# Altium schematic sheet type-c_拓展板.SchDoc
size A4
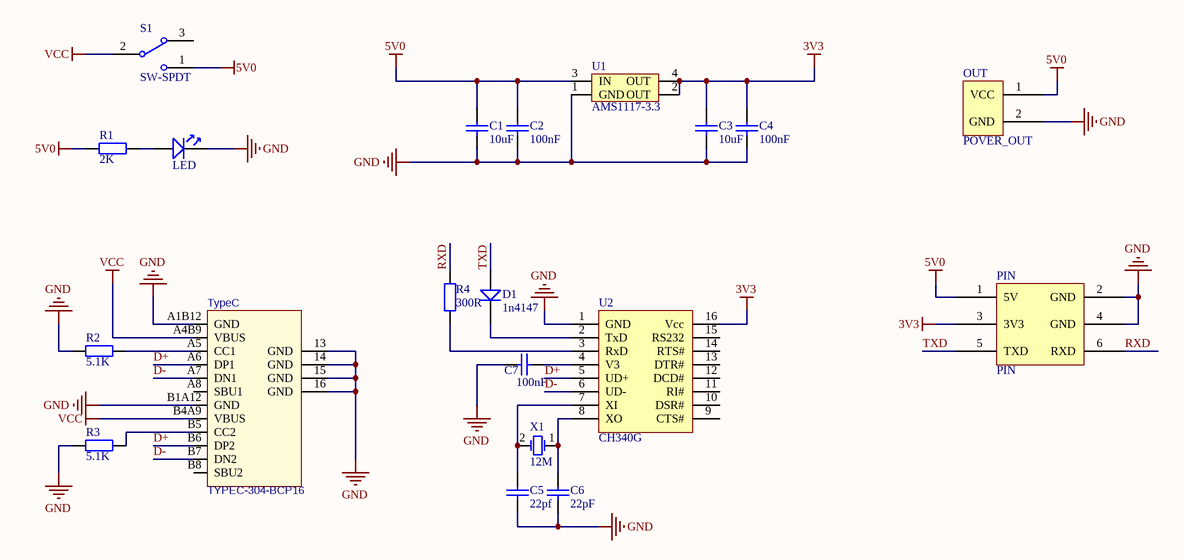
[diagram p0: type-c_拓展板.SchDoc]

## Parts
C1  10uF  [C0603]
C2  100nF  [C0603]
C3  10uF  [C0603]
C4  100nF  [C0603]
C5  22pf  [C0603]
C6  22pF  [C0603]
C7  100nF  [C0603]
D1  1n4147  [DIODE-SMA]
OUT  POVER_OUT  [P]
PIN  PIN  [HDR2.54-LI-2x3P]
PWR?  LED  [LED 0603R]
R1  2K  [R0603]
R2  5.1K  [R0603]
R3  5.1K  [R0603]
R4  300R  [R0603]
S1  SW-SPDT  [S]
TypeC  TYPEC-304-BCP16  [USB-C-SMD_TYPEC-304-BCP16]
U1  AMS1117-3.3  [AMS1117]
U2  CH340G  [SOP16_L]
X1  12M  [XTAL]

## Nets
3V3: C3.2 C4.2 PIN.3(3V3) U1.2(OUT) U1.4(OUT) U2.16(Vcc)
5V0: C1.2 C2.2 OUT.1(VCC) PIN.1(5V) R1.1 S1.1 U1.3(IN)
GND: C1.1 C2.1 C3.1 C4.1 C5.1 C6.1 C7.1 OUT.2(GND) PIN.2(GND) PIN.4(GND) PWR?.2 R2.1 R3.1 TypeC.13(GND) TypeC.14(GND) TypeC.15(GND) TypeC.16(GND) TypeC.A1B12(GND) TypeC.B1A12(GND) U1.1(GND) U2.1(GND)
VCC: S1.2 TypeC.A4B9(VBUS) TypeC.B4A9(VBUS)
D+: TypeC.A6(DP1) TypeC.B6(DP2) U2.5(UD+)
D-: TypeC.A7(DN1) TypeC.B7(DN2) U2.6(UD-)
RXD: PIN.6(RXD) R4.2
TXD: D1.1(+) PIN.5(TXD)
NetC5_2: C5.2 U2.7(XI) X1.2(OSC2)
NetC6_2: C6.2 U2.8(XO) X1.1(OSC1)
NetC7_2: C7.2 U2.4(V3)
NetD1_2: D1.2 U2.2(TxD)
NetPWR?_1: PWR?.1(+) R1.2
NetR2_2: R2.2 TypeC.A5(CC1)
NetR3_2: R3.2 TypeC.B5(CC2)
NetR4_1: R4.1 U2.3(RxD)

Not connected (* = marked no-connect by the designer): S1 3; TypeC A8(SBU1) B8(SBU2); U2 9(CTS#) 10(DSR#) 11(RI#) 12(DCD#) 13(DTR#) 14(RTS#) 15(RS232)

## Library data of the parts
C1-C7 = Cap: 贴片电容; value: 100uf
D1 = D: 二极管
OUT = POVER_IN
R1-R4 = R
S1 = SW-SPDT: 开关; Published: 24-Mar-1999; LatestRevisionDate: 17-Dec-2003; LatestRevisionNote: Schematic revised, PCB Footprint replaced.; DatasheetDocument: 05-Dec-2000; PackageReference: TL36WW15050; Publisher: Altium Limited; ComponentLink1Description: Manufacturer Link; ComponentLink1URL: http://www.apem.com
TypeC = TYPEC-304-BCP16: BOM_Manufacturer: XUNPU; Contributor: LCSC; BOM_Supplier: LCSC; BOM_Supplier Part: C720629; BOM_Manufacturer Part: TYPEC-304-BCP16; spicePre: U; spiceSymbolName: TYPEC-304-BCP16
U1 = AMS1117
U2 = CH340G: 串口转USB; 版权归属: 源创客; BOM名称: 串口转USB; 学习资源: www.ooocke.com
X1 = XTAL: value: *